# EAGLE design BikeLight (EAGLE 9.5.1)
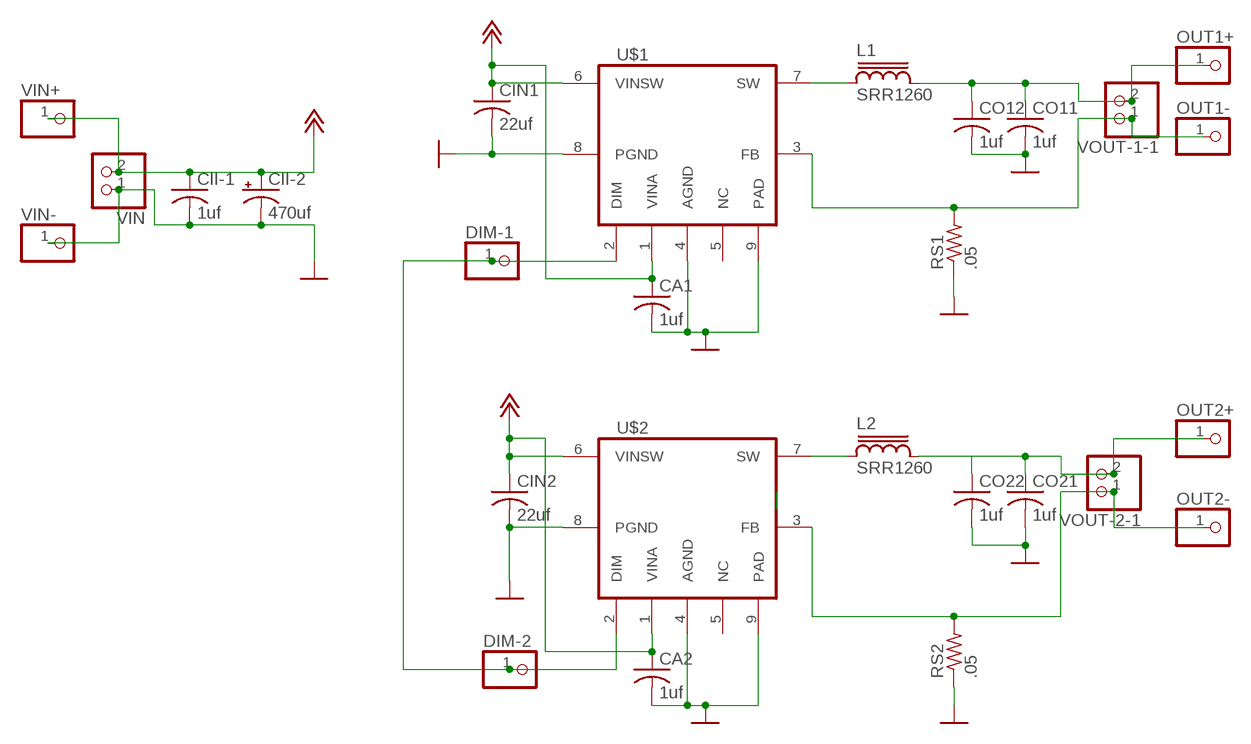
[diagram p0: schematic, sheet 1]

## Parts
CA1  1uf  C-USC1210  [C1210]
CA2  1uf  C-USC1210  [C1210]
CII-1  1uf  C-USC1210  [C1210]
CII-2  470uf  CPOL-USUD-10X10  [UD-10X10_NICHICON]
CIN1  22uf  C-USC1210  [C1210]
CIN2  22uf  C-USC1210  [C1210]
CO11  1uf  C-USC1210  [C1210]
CO12  1uf  C-USC1210  [C1210]
CO21  1uf  C-USC1210  [C1210]
CO22  1uf  C-USC1210  [C1210]
DIM-1  PINHD-1X1  [1X01]
DIM-2  PINHD-1X1  [1X01]
L1  SRR1260  [SRR1260]
L2  SRR1260  [SRR1260]
OUT1+  PINHD-1X1  [1X01]
OUT1-  PINHD-1X1  [1X01]
OUT2+  PINHD-1X1  [1X01]
OUT2-  PINHD-1X1  [1X01]
RS1  .05  R-US_R1206  [R1206]
RS2  .05  R-US_R1206  [R1206]
U$1  LED2001PHR  [SOIC127P600X170-9N]
U$2  LED2001PHR  [SOIC127P600X170-9N]
VIN  PINHD-1X2  [1X02]
VIN+  PINHD-1X1  [1X01]
VIN-  PINHD-1X1  [1X01]
VOUT-1-1  PINHD-1X2  [1X02]
VOUT-2-1  PINHD-1X2  [1X02]

## Nets
+12V: CA1.1 CA2.1 CII-1.1 CII-2.+ CIN1.1 CIN2.1 U$1.1(VINA) U$1.6(VINSW) U$2.1(VINA) U$2.6(VINSW) VIN+.1 VIN.2
GND: CA1.2 CA2.2 CII-1.2 CII-2.- CIN1.2 CIN2.2 CO11.2 CO12.2 CO21.2 CO22.2 RS1.1 RS2.1 U$1.4(AGND) U$1.8(PGND) U$1.9(PAD) U$2.4(AGND) U$2.8(PGND) U$2.9(PAD) VIN-.1 VIN.1
N$1: DIM-1.1 DIM-2.1 U$1.2(DIM) U$2.2(DIM)
N$3: L1.1 U$1.7(SW)
N$4: L2.1 U$2.7(SW)
N-OUT-1-N: OUT1-.1 RS1.2 U$1.3(FB) VOUT-1-1.1
N-OUT-1-P: CO11.1 CO12.1 L1.2 OUT1+.1 VOUT-1-1.2
N-OUT-2-N: OUT2-.1 RS2.2 U$2.3(FB) VOUT-2-1.1
N-OUT-2-P: CO21.1 CO22.1 L2.2 OUT2+.1 VOUT-2-1.2
Unconnected: U$1.5(NC) U$2.5(NC)

## Library data of the parts
CA1 CA2 CII-1 CIN1 CIN2 CO11 CO12 CO21 CO22 = rcl:C-US: CAPACITOR, American symbol; SPICEPREFIX: C
CII-2 = rcl:CPOL-US: POLARIZED CAPACITOR, American symbol; SPICEPREFIX: C
DIM-1 DIM-2 OUT1+ OUT1- OUT2+ OUT2- VIN+ VIN- = pinhead:PINHD-1X1: PIN HEADER
L1 L2 = inductor-bourns:SRR1260: POWER INDUCTOR
RS1 RS2 = rcl:R-US_: RESISTOR, American symbol; SPICEPREFIX: R
U$1 U$2 = CustomParts:LED2001PHR
VIN VOUT-1-1 VOUT-2-1 = pinhead:PINHD-1X2: PIN HEADER

## Net classes
0 default: clearance 0.205 mm

## Board
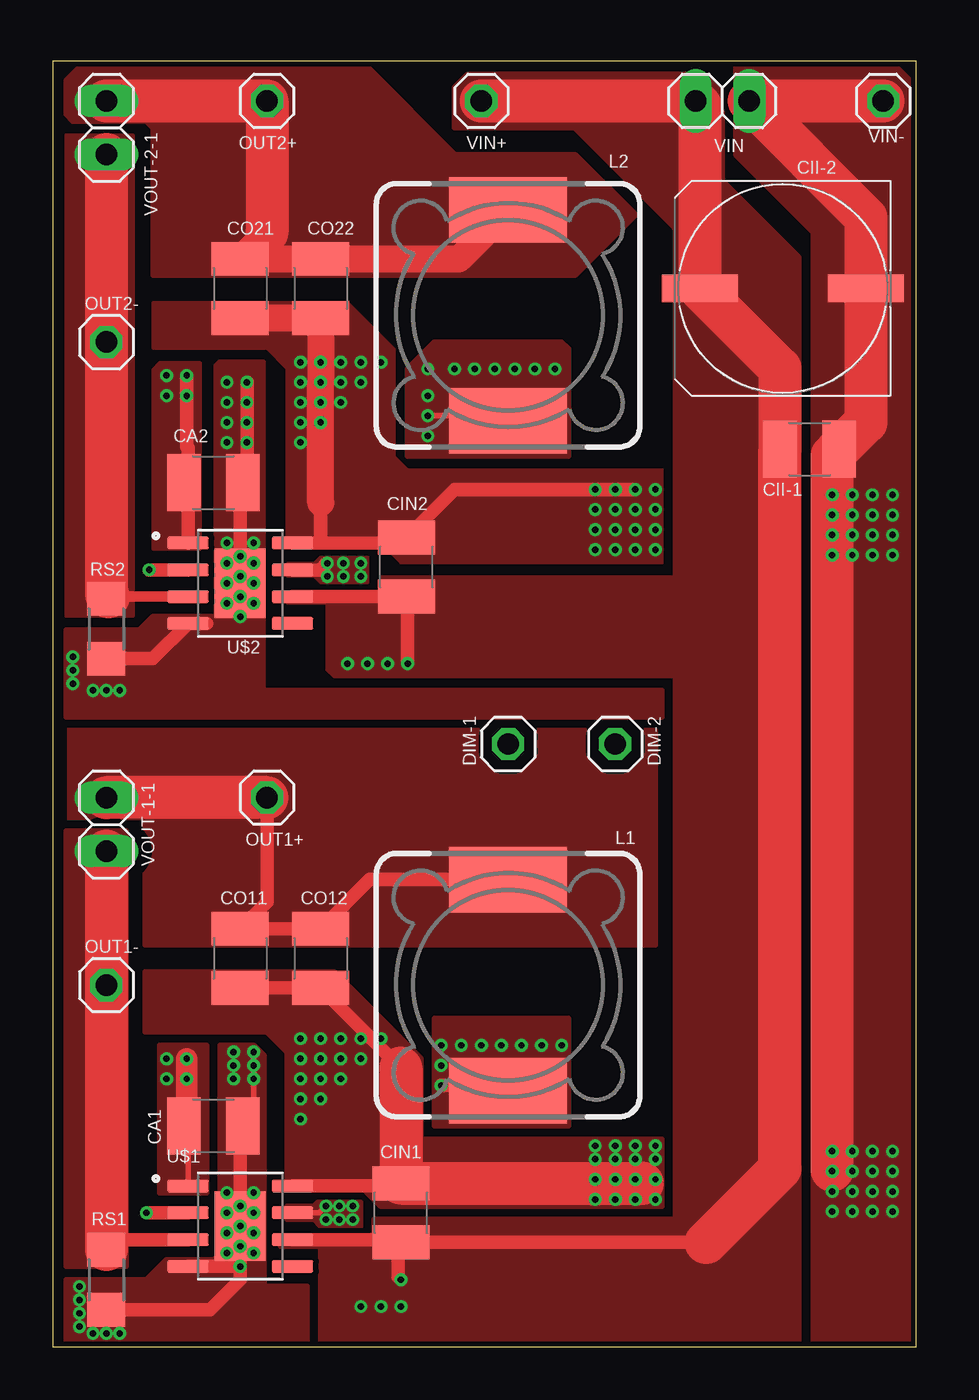
[diagram p1: board, top side]
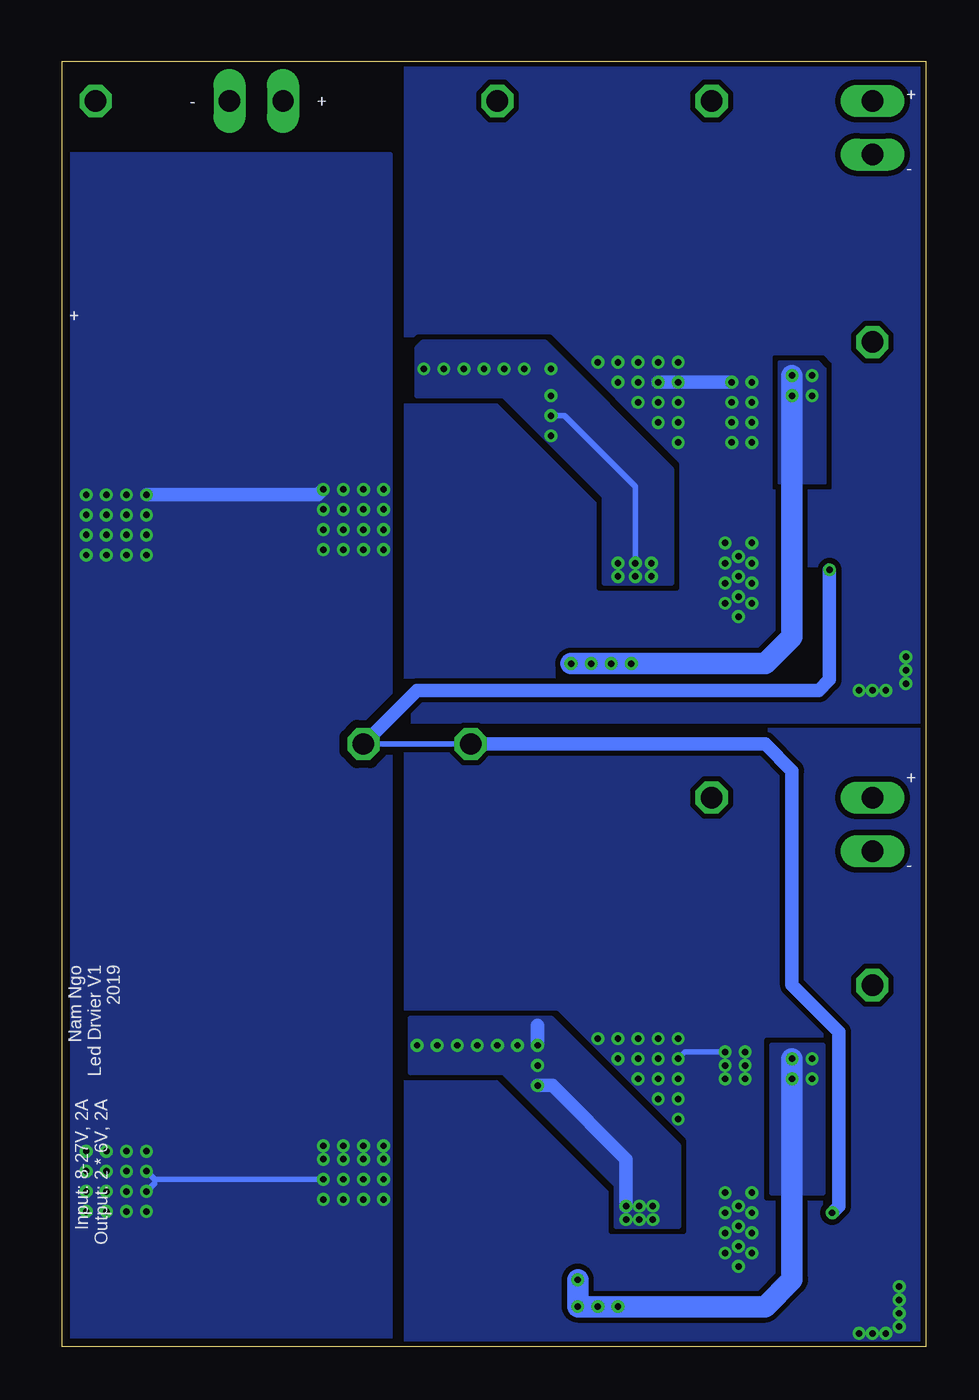
[diagram p2: board, bottom side, seen from below]

Size 40.95 x 60.95 mm. Coordinates in mm from the lower left corner, seen from the top.
Outline: 0,0 40.95,0 40.95,60.95 0,60.95 0,0
Copper layers (1*16): Top 0.035mm / dielectric 1.5mm / Bottom 0.035mm
Design rules "dirt_cheap_dirty_boards.v1.1": minimum track width 6mil, minimum drill 12mil, track to track 6mil, track to pad 6mil, pad to pad 6mil, via to via 6mil, smd to smd 0mil, copper to edge 10mil, drill to drill 10mil, minimum pad ring 10mil, minimum via ring 6mil, stop-mask expansion 2mil, vias tented up to drill 25mil, thermal gap 10mil

### Footprints (pad centres in the part's own frame; a part is rotated, then mirrored left to right if it is on the bottom)
C1210 = smd 1.6 x 2.7: 1 -1.4,0; 2 1.4,0
UD-10X10_NICHICON = smd 3.6 x 1.3: + 3.925,0; - -3.95,0
1X01 = drill 1.016 octagon: 1 0,0
SRR1260 = smd 5.6 x 3.1: 1 0,5; 2 0,-5
R1206 = smd 1.6 x 1.803: 1 -1.422,0; 2 1.422,0
SOIC127P600X170-9N = smd 1.97 x 0.6: 1 -2.475,1.905; 2 -2.475,0.635; 3 -2.475,-0.635; 4 -2.475,-1.905; 5 2.475,-1.905; 6 2.475,-0.635; 7 2.475,0.635; 8 2.475,1.905 | smd 2.41 x 3.3: 9 0,0
1X02 = drill 1.016 long: 1 -1.27,0; 2 1.27,0

### Placement (x,y rotation side)
CA1  7.62,10.48 0 top
CA2  7.62,40.96 0 top
CII-1  35.88,42.55 0 top
CII-2  34.61,50.17 180 top
CIN1  16.51,6.35 90 top
CIN2  16.76,36.96 90 top
CO11  8.89,18.41 270 top
CO12  12.7,18.41 270 top
CO21  8.89,50.17 270 top
CO22  12.7,50.17 270 top
DIM-1  21.59,28.57 0 top
DIM-2  26.67,28.57 0 top
L1  21.59,17.14 180 top
L2  21.59,48.9 180 top
OUT1+  10.16,26.04 0 top
OUT1-  2.54,17.14 0 top
OUT2+  10.16,59.05 0 top
OUT2-  2.54,47.62 0 top
RS1  2.54,3.17 90 top
RS2  2.54,34.04 90 top
U$1  8.89,5.72 0 top
U$2  8.89,36.2 0 top
VIN  31.75,59.05 180 top
VIN+  20.32,59.05 0 top
VIN-  39.37,59.05 0 top
VOUT-1-1  2.54,24.77 90 top
VOUT-2-1  2.54,57.79 90 top

### Tracks (layer width: path | path; a pad name or v marks a point on that pad's centre or on a via)
+12V  (via drill 0.3, 0.3 pad 0.55)
  Top 0.254: U$1.1 6.41,10.28
  Top 0.635: U$1.6 16.38,5.08 | 16.38,5.08 CIN1.1 30.98,4.95 | 6.41,10.28 CA1.1 | v16.51,3.17 16.38,3.31 16.38,5.08 | U$2.6 CIN2.1 16.83,35.49 v16.83,32.39 | U$2.1 6.41,42.61 6.35,42.68 v6.35,46.04
  Top 1.016: v6.35,13.65 6.35,10.61 CA1.1
  Top 2.032: VIN+.1 VIN.2 30.68,58.85 CII-2.+ 34.48,46.37 CII-1.1 34.48,8.44 30.98,4.95
  Bottom 1.016: v16.83,32.39 7.62,32.39 6.35,33.66 v6.35,46.04 | v16.51,3.17 v16.51,1.91 7.62,1.91 6.35,3.17 v6.35,13.65
  other vias: 15.88,32.39 14.92,32.39 13.97,32.39 5.4,46.04 5.4,45.09 6.35,45.09 15.56,1.91 14.6,1.91 5.4,13.65 5.4,12.7 6.35,12.7
  pour Top (isolate 0.254, no thermals): 19.69,60.33 30.8,60.33 31.75,59.37 31.75,55.25 35.37,51.63 35.37,0.19 29.53,0.19 29.53,53.02 24.77,57.79 19.05,57.79 19.05,59.69
  pour Top (isolate 0.254, no thermals): 11.11,35.56 15.56,35.56 15.56,36.51 33.66,36.51 33.66,31.75 13.34,31.75 13.02,32.07 13.02,35.24 11.11,35.24
  pour Top (isolate 0.254, no thermals): 6.98,37.78 4.76,37.78 4.76,46.36 5.08,46.67 6.98,46.67
  pour Bottom (isolate 0.254): 6.98,40.96 4.76,40.96 4.76,46.36 5.08,46.67 6.98,46.67
  pour Top (isolate 0.254, no thermals): 10.79,5.08 14.92,5.08 15.24,5.4 15.24,6.03 34.92,6.03 34.92,0.32 12.7,0.32 12.7,4.76 10.79,4.76
  pour Bottom: 7.3,7.3 7.3,14.29 4.89,14.29 4.89,7.3
  pour Top (no thermals): 7.3,7.3 7.3,14.29 5.08,14.29 5.08,7.3
GND  (via drill 0.3)
  Top 0.254: v9.52,13.97 9.52,10.98 CA1.2
  Top 0.508: CIN2.2 17.52,39.11
  Top 0.635: U$2.8 12.7,38.1 | v8.89,3.81 8.89,3.17 7.47,1.75 RS1.1 | v8.89,3.81 U$1.9 | CO11.2 CO12.2 16.51,13.2 | U$1.8 16.38,7.62 CIN1.2 | 12.7,40.01 12.7,38.1 | 12.7,38.1 16.51,38.1 CIN2.2 19.05,40.64 v27.62,40.64 | v9.21,45.72 9.21,41.15 CA2.2 | 7.3,34.29 U$2.4 4.74,32.61 RS2.1 | v8.89,36.51 8.73,36.67 | 8.89,37.78 8.89,40.83 | 9.02,5.84 U$1.9 | 9.02,5.84 U$1.9 | 9.02,9.84 CA1.2 8.89,10.35 U$1.9 | U$1.4 v8.89,3.81
  Top 1.27: CO21.2 CO22.2 v12.7,45.72 12.7,40.01
  Top 2.032: 16.51,13.2 CIN1.2 27.94,7.75 | VIN-.1 VIN.1 38.56,53.52 CII-2.- 38.56,43.83 CII-1.2 36.96,42.23 36.96,35.31 36.96,8.39
  Bottom 0.254: 36.57,7.75 v36.96,7.37 | v28.58,7.94 36.58,7.94 v36.96,8.32 | v9.52,13.97 11.43,13.97 v11.75,13.65
  Bottom 0.635: v12.7,45.72 v9.21,45.72 | v36.96,40.39 28.83,40.39 v28.58,40.64
  other vias: 27.62,38.73 9.52,37.15 8.25,37.15 9.52,35.24 8.25,35.24 13.65,45.72 13.65,46.67 12.7,46.67 13.65,44.77 14.6,46.67 14.6,45.72 12.7,44.77 11.75,44.77 11.75,45.72 11.75,46.67 11.75,43.82 12.7,43.82 11.75,42.86 15.56,46.67 0.95,32.7 0.95,32.07 1.91,31.11 2.54,31.11 3.18,31.11 0.95,31.43 26.67,40.64 25.72,40.64 27.62,39.69 26.67,38.73 25.72,38.73 26.67,39.69 25.72,39.69 25.72,37.78 26.67,37.78 27.62,37.78 28.58,39.69 28.58,38.73 28.58,37.78 37.91,40.39 38.86,40.39 39.81,40.39 39.81,39.43 38.86,39.43 37.91,39.43 36.96,39.43 39.81,38.48 38.86,38.48 37.91,38.48 36.96,38.48 39.81,37.53 38.86,37.53 37.91,37.53 36.96,37.53 8.25,45.72 8.25,44.77 9.21,44.77 36.96,9.27 37.91,9.27 38.86,9.27 39.81,9.27 39.81,8.32 38.86,8.32 37.91,8.32 39.81,7.37 38.86,7.37 37.91,7.37 39.81,6.41 38.86,6.41 37.91,6.41 36.96,6.41 27.62,7.94 27.62,8.89 26.67,7.94 25.72,7.94 26.67,8.89 25.72,8.89 25.72,6.99 26.67,6.99 27.62,6.99 28.58,8.89 28.58,6.99 25.72,9.52 26.67,9.52 27.62,9.52 28.58,9.52 15.56,14.61 14.6,14.61 13.65,14.61 12.7,14.61 11.75,14.61 11.75,12.7 11.75,11.75 11.75,10.8 14.6,13.65 13.65,13.65 12.7,13.65 12.7,12.7 13.65,12.7 12.7,11.75 9.52,13.34 8.57,13.97 8.57,13.34 8.25,43.82 9.21,43.82 8.25,42.86 9.21,42.86 8.57,12.7 9.52,12.7 9.52,38.1 8.25,38.1 8.89,37.47 9.52,36.2 8.25,36.2 8.89,35.56 8.89,34.61 9.52,6.35 8.25,6.35 8.89,5.72 9.52,4.45 8.25,4.45 9.52,7.3 8.25,7.3 8.89,6.67 9.52,5.4 8.25,5.4 8.89,4.76 1.27,2.86 1.27,2.22 1.27,1.59 1.27,0.95 1.91,0.64 2.54,0.64 3.18,0.64
  pour Top (isolate 0.254, no thermals): 32.38,60.64 40.01,60.64 40.64,60.01 40.64,0.32 36.07,0.32 36.07,52.83 32.38,56.52
  pour Top (isolate 0.254, no thermals): 4.76,49.53 13.97,49.53 16.19,47.31 16.19,42.23 16.83,41.59 28.89,41.59 28.89,37.15 16.51,37.15 15.56,38.1 11.11,38.1 11.11,46.36 10.16,47.31 4.76,47.31
  pour Top (isolate 0.254, no thermals): 0.63,33.97 0.63,29.85 28.89,29.85 28.89,31.11 9.97,31.11 9.97,46.67 7.94,46.67 7.75,46.48 7.75,34.61 4.76,34.61 4.13,33.97
  pour Bottom (isolate 0.254, rank 5): 24.45,29.85 24.45,60.64 0,60.64 0,29.85
  pour Bottom (isolate 0.381): 25.4,56.52 40.64,56.52 40.64,0.19 25.4,0.19
  pour Top (isolate 0.254, no thermals): 28.89,6.67 15.56,6.67 14.6,7.62 11.11,7.62 11.11,13.97 10.16,14.92 4.38,14.92 4.38,17.78 13.34,17.78 17.46,13.65 17.46,9.84 28.89,9.84
  pour Top (no thermals): 0.63,3.17 4.45,3.17 5.4,4.13 7.62,4.13 7.94,4.45 7.94,14.29 9.52,14.29 10.03,13.78 10.03,2.86 12.06,2.86 12.06,0.32 0.63,0.32
  pour Bottom (isolate 0.254, rank 5): 0.32,29.21 24.64,29.21 24.64,0.32 0.32,0.32
N$1  (via drill 0.3)
  Top 0.635: U$1.2 v4.45,6.35 | U$2.2 v4.57,36.83
  Bottom 0.254: DIM-2.1 DIM-1.1
  Bottom 0.635: v4.45,6.35 4.13,6.67 4.13,14.92 6.35,17.14 6.35,27.3 7.62,28.57 DIM-1.1 | v4.57,36.83 4.57,31.62 5.08,31.11 24.13,31.11 DIM-2.1
N$3  (via drill 0.3)
  Top 0.254: U$1.7 12.64,6.35 v12.95,6.67
  Top 0.635: v18.41,12.38 21.35,12.38 L1.1
  Bottom 0.635: v14.22,6.67 14.22,8.89 17.72,12.38 v18.41,12.38 | v18.41,14.29 18.41,15.24
  other vias: 13.59,6.67 14.22,6.03 12.95,6.03 13.59,6.03 24.13,14.29 23.18,14.29 22.23,14.29 21.27,14.29 20.32,14.29 19.37,14.29 18.41,13.34
  pour Top (isolate 0.254, no thermals): 11.11,6.67 12.38,6.67 12.57,6.86 14.6,6.86 14.6,5.72 12.7,5.72 12.38,6.03 11.11,6.03
  pour Top (isolate 0.254, no thermals): 24.45,10.48 24.45,15.56 18.1,15.56 18.1,10.48
  pour Bottom (isolate 0.254, no thermals): 11.75,5.72 14.67,5.72 14.67,7.68 20,13.02 24.45,13.02 24.45,15.56 17.78,15.56 11.75,9.52
N$4  (via drill 0.3)
  Top 0.254: v17.78,44.13 21.35,44.13 L2.1
  Top 0.635: v13.02,37.15 12.7,36.83 U$2.7
  Bottom 0.254: v13.78,37.15 13.78,40.77 17.15,44.13 v17.78,44.13
  other vias: 13.78,36.51 13.02,36.51 23.81,46.36 22.86,46.36 21.91,46.36 20.95,46.36 17.78,45.09 20,46.36 19.05,46.36 17.78,43.18 17.78,46.36 14.6,37.15 14.6,36.51
  pour Bottom (isolate 0.254): 12.06,36.2 15.24,36.2 15.24,40.32 20,45.09 24.13,45.09 24.13,47.31 23.81,47.62 18.1,47.62 12.06,41.59
  pour Top (isolate 0.254, no thermals): 24.45,42.23 24.45,47.31 24.13,47.62 18.1,47.62 16.83,46.36 16.83,42.23
  pour Top (isolate 0.254, no thermals): 11.11,37.15 12.38,37.15 12.7,37.47 14.92,37.47 14.92,36.2 12.7,36.2 12.38,36.51 11.11,36.51
N-OUT-1-N
  Top 0.635: U$1.3 3.02,5.08 RS1.2
  Top 2.032: VOUT-1-1.1 OUT1-.1 RS1.2
  pour Top (no thermals): 3.49,3.81 3.49,24.45 0.63,24.45 0.63,3.81
N-OUT-1-P
  Top 0.635: L1.2 15.03,22.14 CO12.1 CO11.1 10.16,21.09 OUT1+.1
  Top 2.032: OUT1+.1 VOUT-1-1.2
  pour Top (isolate 0.635, no thermals): 4.38,19.05 28.58,19.05 28.58,29.21 0.63,29.21 0.63,25.08 4.38,25.08
N-OUT-2-N
  Top 0.508: U$2.3 2.64,35.56 RS2.2
  Top 2.032: VOUT-2-1.1 OUT2-.1 2.54,35.66 2.64,35.56
  pour Top (isolate 0.254, no thermals): 0.63,57.47 3.81,57.47 3.81,34.61 0.95,34.61 0.63,34.61
N-OUT-2-P
  Top 1.27: L2.2 19.26,51.57 CO22.1 CO21.1 10.16,52.84
  Top 2.032: VOUT-2-1.2 OUT2+.1 10.16,52.84
  pour Top (isolate 0.254, no thermals): 27.62,53.66 24.77,56.52 19.05,56.52 14.92,60.64 1.27,60.64 0.63,60.01 0.63,58.42 0.95,58.1 4.45,58.1 4.76,57.79 4.76,50.8 24.77,50.8

### Text on the board
bPlace: + | + | - | - | + | + | - | Nam Ngo / Led Drvier V1 / 2019 | Input: 8-27V, 2A / Output: 2 * 6V, 2A